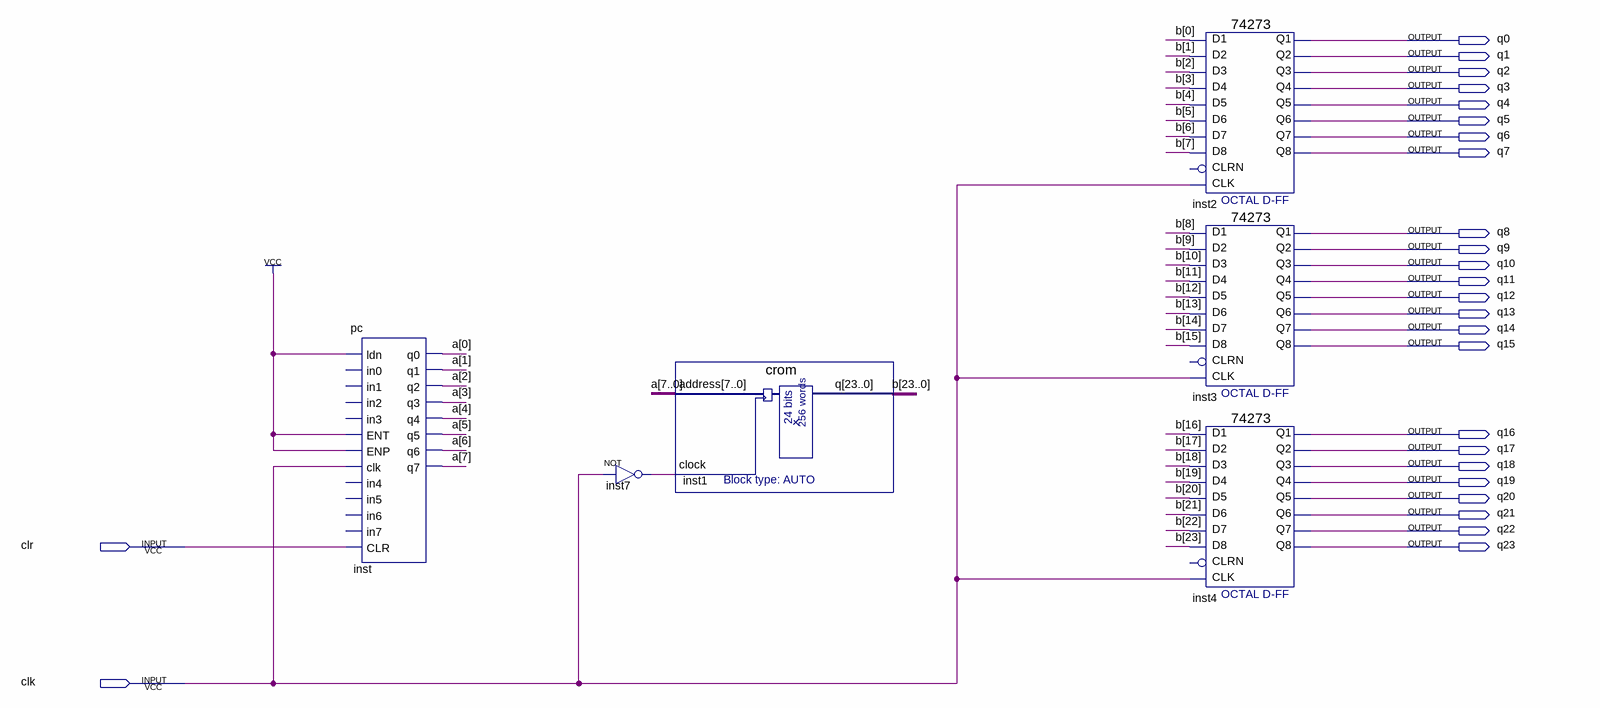
[diagram p0: schematic sheet]
// Quartus schematic 13.bdf as structural Verilog: 6 symbols, 26 pins
module \13  (
  input  clr,
  input  clk,
  output q0,
  output q1,
  output q2,
  output q3,
  output q4,
  output q5,
  output q6,
  output q7,
  output q8,
  output q9,
  output q10,
  output q11,
  output q12,
  output q13,
  output q14,
  output q15,
  output q16,
  output q17,
  output q18,
  output q19,
  output q20,
  output q21,
  output q22,
  output q23
);

  wire inst7_out;
  wire [7:0] a;
  wire [23:0] b;

  pc inst (
    .ldn(1'b1), .ENT(1'b1), .ENP(1'b1), .clk(clk), .CLR(clr), .q0(a[0]), .q1(a[1]), .q2(a[2]), .q3(a[3]),
    .q4(a[4]), .q5(a[5]), .q6(a[6]), .q7(a[7]));  // open: in0, in1, in2, in3, in4, in5, in6, in7
  not inst7 (inst7_out, clk);
  crom inst1 (.address(a), .clock(inst7_out), .q(b));
  \74273  inst2 (
    .D2(b[1]), .D3(b[2]), .D1(b[0]), .D4(b[3]), .D7(b[6]), .D6(b[5]), .D5(b[4]), .D8(b[7]), .CLK(clk),
    .Q4(q3), .Q1(q0), .Q2(q1), .Q3(q2), .Q6(q5), .Q5(q4), .Q7(q6), .Q8(q7));  // open: CLRN
  \74273  inst3 (
    .D2(b[9]), .D3(b[10]), .D1(b[8]), .D4(b[11]), .D7(b[14]), .D6(b[13]), .D5(b[12]), .D8(b[15]), .CLK(clk),
    .Q4(q11), .Q1(q8), .Q2(q9), .Q3(q10), .Q6(q13), .Q5(q12), .Q7(q14), .Q8(q15));  // open: CLRN
  \74273  inst4 (
    .D2(b[17]), .D3(b[18]), .D1(b[16]), .D4(b[19]), .D7(b[22]), .D6(b[21]), .D5(b[20]), .D8(b[23]),
    .CLK(clk), .Q4(q19), .Q1(q16), .Q2(q17), .Q3(q18), .Q6(q21), .Q5(q20), .Q7(q22), .Q8(q23));  // open: CLRN
endmodule
